# Altium schematic sheet xbowtie3.SchDoc
size A3; SheetNumber: 3; SheetTotal: 3
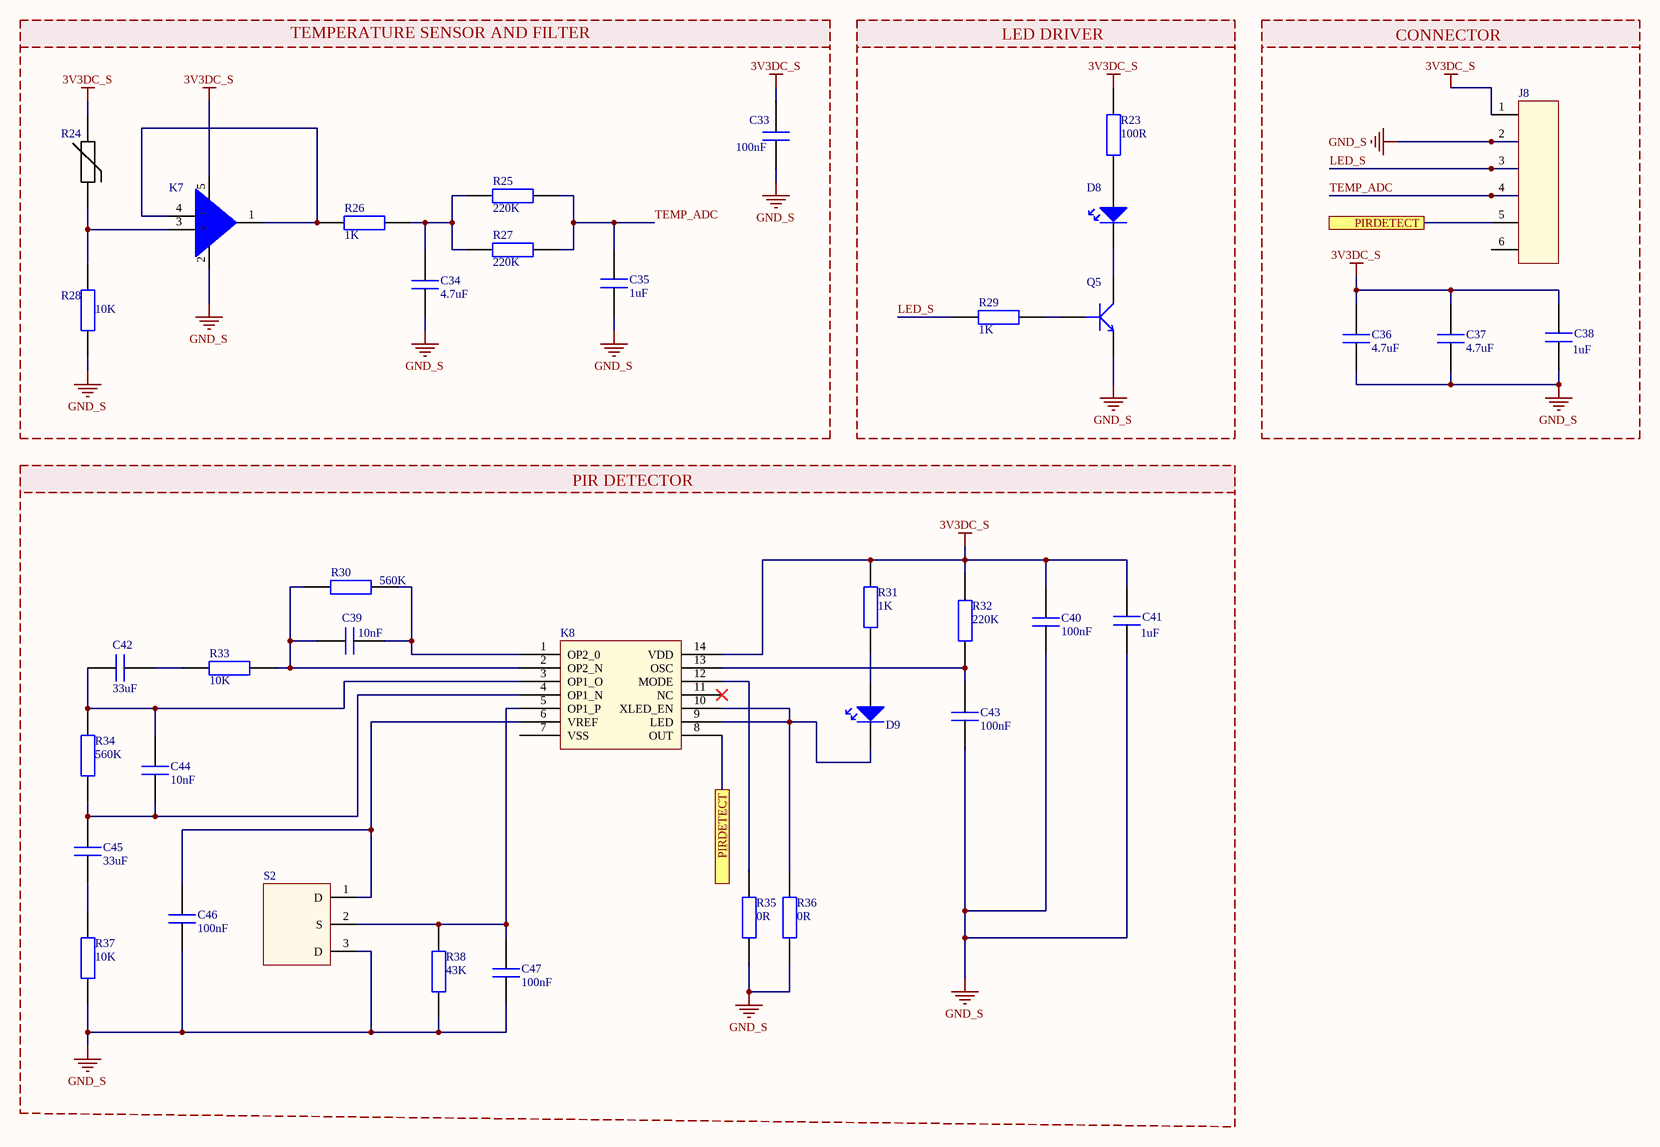
[diagram p0: xbowtie3.SchDoc]

## Parts
C33  100nF  [CAP_CER 0805]
C34  4.7uF  [CAP_CER 0805]
C35  Capacitance: 1uF  [CAP_CER 0805]  (hidden comment: CAP CER 1uF 0805)
C36  4.7uF  [CAP_CER 0805]
C37  4.7uF  [CAP_CER 0805]
C38  Capacitance: 1uF  [CAP_CER 0805]  (hidden comment: CAP CER 1uF 0805)
C39  10nF
C40  Capacitance: 100nF  (hidden comment: CAP CER 100nF 0603)
C41  Capacitance: 1uF  [CAP_CER 0805]  (hidden comment: CAP CER 1uF 0805)
C42  33uF  [CAP 1206]
C43  Capacitance: 100nF  (hidden comment: CAP CER 100nF 0603)
C44  10nF
C45  33uF  [CAP 1206]
C46  Capacitance: 100nF  (hidden comment: CAP CER 100nF 0603)
C47  Capacitance: 100nF  (hidden comment: CAP CER 100nF 0603)
D8  LED RED 0805  [LED 805]  (value not drawn)
D9  LED GREEN  [LED 805]  (value not drawn)
J8  64800611622  [64800611622]  (value not drawn)
K7  OPA314AIDBVR  [OPA314AIDBVR]  (value not drawn)
K8  NCS36000DRG  [NCS36000DRG]  (value not drawn)
Q5  MMBT3904-7-F  [MMBT3904-7-F]  (value not drawn)
R23  100R  [RES_0603]
R24  TFPT1206L1002FM  [TFPT1206L1002FM]  (value not drawn)
R25  220K  [RES_0603]
R26  1K  [RES_0603]
R27  220K  [RES_0603]
R28  10K  [RES_0603]
R29  1K  [RES_0603]
R30  560K  [RES_0603]
R31  1K  [RES_0603]
R32  220K  [RES_0603]
R33  10K  [RES_0603]
R34  560K  [RES_0603]
R35  0R  [RES_0603]
R36  0R  [RES_0603]
R37  10K  [RES_0603]
R38  43K  [RES_0603]
S2  LHI 878/3902  [LHI 878]  (value not drawn)

## Ports
PIRDETECT

## Nets
3V3DC_S: C33.2 C36.2 C37.2 C38.2 C40.2 C41.2 J8.1(VCC) K7.5(V+) K8.14(VDD) R23.2 R24.2 R31.2 R32.2
GND_S: C33.1 C34.1 C35.1 C36.1 C37.1 C38.1 C40.1 C41.1 C43.1 C46.1 C47.1 J8.2(RX) K7.2(V-) Q5.2(E) R28.2 R35.1 R36.1 R37.1 R38.1 S2.3(D)
LED_S: J8.3(TX) R29.1
PIRDETECT: J8.5(GND) K8.8(OUT) ; port PIRDETECT
TEMP_ADC: C35.2 J8.4(NC) R25.2 R27.2
NetC34_2: C34.2 R25.1 R26.2 R27.1
NetC39_1: C39.1 K8.2(OP2_N) R30.1 R33.2
NetC39_2: C39.2 K8.1(OP2_0) R30.2
NetC42_1: C42.1 C44.2 K8.3(OP1_O) R34.2
NetC42_2: C42.2 R33.1
NetC43_2: C43.2 K8.13(OSC) R32.1
NetC44_1: C44.1 C45.2 K8.4(OP1_N) R34.1
NetC45_1: C45.1 R37.2
NetC46_2: C46.2 K8.6(VREF) S2.1(D)
NetC47_2: C47.2 K8.5(OP1_P) R38.2 S2.2(S)
NetD8_1: D8.1 Q5.C
NetD8_2: D8.2 R23.1
NetD9_1: D9.1 K8.9(LED) K8.10(XLED_EN) R36.2
NetD9_2: D9.2 R31.1
NetK7_1: K7.1(OUT) K7.4(-) R26.1
NetK7_3: K7.3(+) R24.1 R28.1
NetK8_12: K8.12(MODE) R35.2
NetQ5_1: Q5.1(B) R29.2

Not connected (* = marked no-connect by the designer): J8 6(GND); K8 7(VSS) 11(NC)*

## Notes on the sheet
- TEMPERATURE SENSOR AND FILTER
- LED DRIVER
- CONNECTOR
- PIR DETECTOR
- (in symbol OPA314AIDBVR) _

## Library data of the parts
C33 = CAP CER 100nF 0805
C34 C36 C37 = CAP CER 4.7uF 0805: Manufacturer: Samsung; Manufacturer Part Number: CL21A475KBQNNNE; Material: 4241ConductorMaterial; Tolerance: 10%; Voltage Rating: 50V; Dielectric: X5R; Supplier 1: Digikey; RoHS: Yes; Category: Ceramic Capacitors; Stock 1: 277343; Pricing 1: 1=0,23, 10=0,148, 50=0,104, 100=0,084, 500=0,06244, 1000=0,05464 (USD); Mount: Surface Mount; Case/Package: 0805; Case Code (Metric): 2012; Case Code (Imperial): 0805; Min Operating Temperature: -55°C; Max Operating Temperature: 85°C; Packaging: Tape and Reel; Series: CL; Voltage Rating (DC): 50V; Package Quantity: 1; Length: 2mm; Width: 0.049inch; Thickness: 0.055inch; Depth: 1.25mm; Radiation Hardening: No; RoHS Compliant: Yes; ComponentLink1URL: https://datasheet.ciiva.com/25797/cl21a475kbqnnne-25797730.pdf?src-supplier=Digikey; ComponentLink1Description: https://datasheet.ciiva.com/25797/cl21a475kbqnnne-25797730.pdf?src-supplier=Digikey; ComponentLink2URL: https://datasheet.ciiva.com/16428/cl21a475kbqnnne-16428877.pdf?src-supplier=Future+Electronics; ComponentLink2Description: https://datasheet.ciiva.com/16428/cl21a475kbqnnne-16428877.pdf?src-supplier=Future+Electronics; ComponentLink3URL: https://datasheet.ciiva.com/26838/getdatasheetpartid-470982-26838620.pdf?src-supplier=Verical; ComponentLink3Description: https://datasheet.ciiva.com/26838/getdatasheetpartid-470982-26838620.pdf?src-supplier=Verical; Supplier Part Number 1: 1276-1248-1-ND; Capacitance: 4.7uF
C35 C38 C41 = CAP CER 1uF 0805: CAP CER 1uF %10 0805; Manufacturer: Samsung; Manufacturer Part Number: CL21B105KBFNNNE; Material: Ceramic; Tolerance: 10%; Voltage Rating: 50V; Dielectric: X7R; Supplier 1: Digikey; RoHS: Yes; Category: Ceramic Capacitors; Stock 1: 1550845; Pricing 1: 1=0,11, 10=0,075, 50=0,045, 100=0,0354, 500=0,02616, 1000=0,02165 (USD); Mount: Surface Mount; Case/Package: 0805; Case Code (Metric): 2012; Case Code (Imperial): 0805; Min Operating Temperature: -55°C; Max Operating Temperature: 125°C; Packaging: Tape and Reel; Package Quantity: 1; Voltage: 50V; Series: CL; Construction: Flat; Voltage Rating (DC): 50V; Length: 2mm; Width: 0.049inch; Height: 1.25mm; Thickness: 0.053inch; Depth: 1.25mm; Radiation Hardening: No; RoHS Compliant: Yes; ComponentLink1URL: https://datasheet.ciiva.com/25800/cl21b105kbfnnne-25800291.pdf?src-supplier=Digikey; ComponentLink1Description: https://datasheet.ciiva.com/25800/cl21b105kbfnnne-25800291.pdf?src-supplier=Digikey; Supplier Part Number 1: 1276-1029-1-ND
C39 C44 = CAP CER 10nF 0603: Manufacturer: Walsin Technologies; Manufacturer Part Number: 0603B103K160CT; Supplier 1: Digikey; RoHS: Yes; Category: Ceramic Capacitors; Stock 1: 97748; Pricing 1: 1=0,1, 10=0,032, 50=0,0182, 100=0,0141, 500=0,0106, 1000=0,00833 (USD); Lead Free: 5697LeadFree; ComponentLink1URL: http://www.farnell.com/datasheets/1958513.pdf?src-supplier=Farnell; ComponentLink1Description: http://www.farnell.com/datasheets/1958513.pdf?src-supplier=Farnell; ComponentLink2URL: https://datasheet.octopart.com/0603B103K160CT-Walsin-Technologies-datasheet-136037192.pdf?src-supplier=Future+Electronics; ComponentLink2Description: https://datasheet.octopart.com/0603B103K160CT-Walsin-Technologies-datasheet-136037192.pdf?src-supplier=Future+Electronics; ComponentLink3URL: http://www.passivecomponent.com/wp-content/uploads/2018/10/MLCC.pdf?src-supplier=Digikey; ComponentLink3Description: http://www.passivecomponent.com/wp-content/uploads/2018/10/MLCC.pdf?src-supplier=Digikey; ComponentLink4URL: https://datasheet.octopart.com/0603B103K160CT-Walsin-Technologies-datasheet-85392065.pdf?src-supplier=Element14; ComponentLink4Description: https://datasheet.octopart.com/0603B103K160CT-Walsin-Technologies-datasheet-85392065.pdf?src-supplier=Element14; ComponentLink5URL: https://datasheet.octopart.com/0603B103K160CT-Walsin-Technologies-datasheet-62066062.pdf?src-supplier=TME; ComponentLink5Description: https://datasheet.octopart.com/0603B103K160CT-Walsin-Technologies-datasheet-62066062.pdf?src-supplier=TME; Supplier Part Number 1: 1292-1384-1-ND
C40 C43 C46 C47 = CAP CER 100nF 0603: Multilayer Ceramic Capacitor, 0.1 uF, 50 V, ± 10%, X7R, 0603 [1608 Metric]; Manufacturer: KEMET; Manufacturer Part Number: C0603C104K5RACTU; Material: 4241ConductorMaterial; Voltage Rating: 50V; Temperature Coefficient: 30ppm/°C; ComponentLink1URL: https://datasheet.ciiva.com/46444/1769893-46444984.pdf?src-supplier=Element14; ComponentLink1Description: https://datasheet.ciiva.com/46444/1769893-46444984.pdf?src-supplier=Element14; ComponentLink2URL: https://datasheet.ciiva.com/46444/1769893-46444985.pdf?src-supplier=Element14; ComponentLink2Description: https://datasheet.ciiva.com/46444/1769893-46444985.pdf?src-supplier=Element14; ComponentLink3URL: https://datasheet.ciiva.com/14906/partnumbering-e-01-14906427.pdf?src-supplier=Digikey; ComponentLink3Description: https://datasheet.ciiva.com/14906/partnumbering-e-01-14906427.pdf?src-supplier=Digikey; ComponentLink4URL: https://datasheet.ciiva.com/14906/partnumbering-e-01-14906426.pdf?src-supplier=Digikey; ComponentLink4Description: https://datasheet.ciiva.com/14906/partnumbering-e-01-14906426.pdf?src-supplier=Digikey; ComponentLink5URL: https://datasheet.ciiva.com/14906/partnumbering-e-01-14906428.pdf?src-supplier=Digikey; ComponentLink5Description: https://datasheet.ciiva.com/14906/partnumbering-e-01-14906428.pdf?src-supplier=Digikey; Supplier 1: Digikey; Category: Ceramic Capacitors; Stock 1: 3473994; Pricing 1: 1=0,11, 10=0,074, 50=0,0424, 100=0,0329, 500=0,02474, 1000=0,01944 (USD); Mount: Surface Mount; Case/Package: 0603; Min Operating Temperature: -55°C; Max Operating Temperature: 125°C; Tolerance: 10%; Packaging: Tape and Reel; Series: SMD Comm X7R; Dielectric: X7R; Voltage: 50V; Length: 0.063inch; Width: 0.031inch; Thickness: 0.034inch; RoHS Compliant: Yes; Lead Free: 5697LeadFree; ComponentLink6URL: https://datasheet.octopart.com/C0603C104K5RACTU-KEMET-datasheet-176142159.pdf?src-supplier=Farnell; ComponentLink6Description: https://datasheet.octopart.com/C0603C104K5RACTU-KEMET-datasheet-176142159.pdf?src-supplier=Farnell; ComponentLink7URL: https://datasheet.octopart.com/C0603C104K5RACTU-KEMET-datasheet-149521864.pdf?src-supplier=Farnell; ComponentLink7Description: https://datasheet.octopart.com/C0603C104K5RACTU-KEMET-datasheet-149521864.pdf?src-supplier=Farnell; ComponentLink8URL: https://datasheet.octopart.com/C0603C104K5RACTU-KEMET-datasheet-101575654.pdf?src-supplier=Farnell; ComponentLink8Description: https://datasheet.octopart.com/C0603C104K5RACTU-KEMET-datasheet-101575654.pdf?src-supplier=Farnell; ComponentLink9URL: https://datasheet.octopart.com/C0603C104K5RAC-TU-Kemet-datasheet-7833651.pdf?src-supplier=Farnell; ComponentLink9Description: https://datasheet.octopart.com/C0603C104K5RAC-TU-Kemet-datasheet-7833651.pdf?src-supplier=Farnell; ComponentLink10URL: https://datasheet.octopart.com/C0603C104K5RAC-TU-Kemet-datasheet-7601896.pdf?src-supplier=Farnell; ComponentLink10Description: https://datasheet.octopart.com/C0603C104K5RAC-TU-Kemet-datasheet-7601896.pdf?src-supplier=Farnell; ComponentLink11URL: https://datasheet.octopart.com/C0603C104K5RAC-TU-Kemet-datasheet-5316294.pdf?src-supplier=Farnell; ComponentLink11Description: https://datasheet.octopart.com/C0603C104K5RAC-TU-Kemet-datasheet-5316294.pdf?src-supplier=Farnell; ComponentLink12URL: https://datasheet.octopart.com/C0603C104K5RAC-TU-Kemet-datasheet-5314837.pdf?src-supplier=Farnell; ComponentLink12Description: https://datasheet.octopart.com/C0603C104K5RAC-TU-Kemet-datasheet-5314837.pdf?src-supplier=Farnell; ComponentLink13URL: https://datasheet.octopart.com/C0603C104K5RAC-TU-Kemet-datasheet-8092359.pdf?src-supplier=Farnell; ComponentLink13Description: https://datasheet.octopart.com/C0603C104K5RAC-TU-Kemet-datasheet-8092359.pdf?src-supplier=Farnell; ComponentLink14URL: https://datasheet.octopart.com/C0603C104K5RAC-TU-Kemet-datasheet-5314449.pdf?src-supplier=Farnell; ComponentLink14Description: https://datasheet.octopart.com/C0603C104K5RAC-TU-Kemet-datasheet-5314449.pdf?src-supplier=Farnell; ComponentLink15URL: https://datasheet.octopart.com/C0603C104K5RAC-TU-Kemet-datasheet-5314969.pdf?src-supplier=Farnell; ComponentLink15Description: https://datasheet.octopart.com/C0603C104K5RAC-TU-Kemet-datasheet-5314969.pdf?src-supplier=Farnell; ComponentLink16URL: https://datasheet.octopart.com/C0603C104K5RAC-TU-Kemet-datasheet-5314627.pdf?src-supplier=Farnell; ComponentLink16Description: https://datasheet.octopart.com/C0603C104K5RAC-TU-Kemet-datasheet-5314627.pdf?src-supplier=Farnell; ComponentLink17URL: https://datasheet.octopart.com/C0603C104K5RAC-TU-Kemet-datasheet-5389132.pdf?src-supplier=Farnell; ComponentLink17Description: https://datasheet.octopart.com/C0603C104K5RAC-TU-Kemet-datasheet-5389132.pdf?src-supplier=Farnell; ComponentLink18URL: https://datasheet.octopart.com/C0603C104K5RAC-TU-Kemet-datasheet-5313836.pdf?src-supplier=Farnell; ComponentLink18Description: https://datasheet.octopart.com/C0603C104K5RAC-TU-Kemet-datasheet-5313836.pdf?src-supplier=Farnell; ComponentLink19URL: https://datasheet.octopart.com/C0603C104K5RAC-TU-Kemet-datasheet-8111010.pdf?src-supplier=Farnell; ComponentLink19Description: https://datasheet.octopart.com/C0603C104K5RAC-TU-Kemet-datasheet-8111010.pdf?src-supplier=Farnell; ComponentLink20URL: https://datasheet.octopart.com/C0603C104K5RAC-TU-Kemet-datasheet-7627733.pdf?src-supplier=Farnell; ComponentLink20Description: https://datasheet.octopart.com/C0603C104K5RAC-TU-Kemet-datasheet-7627733.pdf?src-supplier=Farnell; ComponentLink21URL: https://datasheet.octopart.com/C0603C104K5RAC-TU-Kemet-datasheet-5315946.pdf?src-supplier=Farnell; ComponentLink21Description: https://datasheet.octopart.com/C0603C104K5RAC-TU-Kemet-datasheet-5315946.pdf?src-supplier=Farnell; ComponentLink22URL: https://datasheet.octopart.com/C0603C104K5RACTU-KEMET-datasheet-171829795.pdf?src-supplier=Newark; ComponentLink22Description: https://datasheet.octopart.com/C0603C104K5RACTU-KEMET-datasheet-171829795.pdf?src-supplier=Newark; ComponentLink23URL: https://datasheet.octopart.com/C0603C104K5RAC-TU-Kemet-datasheet-5313890.pdf?src-supplier=Newark; ComponentLink23Description: https://datasheet.octopart.com/C0603C104K5RAC-TU-Kemet-datasheet-5313890.pdf?src-supplier=Newark; ComponentLink24URL: https://datasheet.octopart.com/C0603C104K5RACTU-Kemet-datasheet-12608295.pdf?src-supplier=Newark; ComponentLink24Description: https://datasheet.octopart.com/C0603C104K5RACTU-Kemet-datasheet-12608295.pdf?src-supplier=Newark; ComponentLink25URL: https://datasheet.octopart.com/C0603C104K5RACTU-Kemet-datasheet-11992184.pdf?src-supplier=Newark; ComponentLink25Description: https://datasheet.octopart.com/C0603C104K5RACTU-Kemet-datasheet-11992184.pdf?src-supplier=Newark; ComponentLink26URL: https://datasheet.octopart.com/C0603C104K5RACTU-Kemet-datasheet-10942409.pdf?src-supplier=Newark; ComponentLink26Description: https://datasheet.octopart.com/C0603C104K5RACTU-Kemet-datasheet-10942409.pdf?src-supplier=Newark; ComponentLink27URL: https://datasheet.octopart.com/C0603C104K5RACTU-Kemet-datasheet-10404442.pdf?src-supplier=Newark; ComponentLink27Description: https://datasheet.octopart.com/C0603C104K5RACTU-Kemet-datasheet-10404442.pdf?src-supplier=Newark; ComponentLink28URL: https://datasheet.octopart.com/C0603C104K5RAC-TU-Kemet-datasheet-5390537.pdf?src-supplier=Newark; ComponentLink28Description: https://datasheet.octopart.com/C0603C104K5RAC-TU-Kemet-datasheet-5390537.pdf?src-supplier=Newark; ComponentLink29URL: https://datasheet.octopart.com/C0603C104K5RAC-TU-Kemet-datasheet-7541751.pdf?src-supplier=Newark; ComponentLink29Description: https://datasheet.octopart.com/C0603C104K5RAC-TU-Kemet-datasheet-7541751.pdf?src-supplier=Newark; ComponentLink30URL: https://datasheet.octopart.com/C0603C104K5RACTU-Kemet-datasheet-8764837.pdf?src-supplier=Newark; ComponentLink30Description: https://datasheet.octopart.com/C0603C104K5RACTU-Kemet-datasheet-8764837.pdf?src-supplier=Newark; ComponentLink31URL: https://datasheet.octopart.com/C0603C104K5RACTU-Kemet-datasheet-8480123.pdf?src-supplier=Newark; ComponentLink31Description: https://datasheet.octopart.com/C0603C104K5RACTU-Kemet-datasheet-8480123.pdf?src-supplier=Newark; ComponentLink32URL: https://datasheet.octopart.com/C0603C104K5RACTU-Kemet-datasheet-5393970.pdf?src-supplier=Newark; ComponentLink32Description: https://datasheet.octopart.com/C0603C104K5RACTU-Kemet-datasheet-5393970.pdf?src-supplier=Newark; ComponentLink33URL: https://datasheet.octopart.com/C0603C104K5RACTU-Kemet-datasheet-8502025.pdf?src-supplier=Newark; ComponentLink33Description: https://datasheet.octopart.com/C0603C104K5RACTU-Kemet-datasheet-8502025.pdf?src-supplier=Newark; ComponentLink34URL: https://datasheet.octopart.com/C0603C104K5RACTU-Kemet-datasheet-161801.pdf?src-supplier=Newark; ComponentLink34Description: https://datasheet.octopart.com/C0603C104K5RACTU-Kemet-datasheet-161801.pdf?src-supplier=Newark; ComponentLink35URL: https://datasheet.octopart.com/C0603C104K5RACTU-Kemet-datasheet-32036385.pdf?src-supplier=Electro+Sonic; ComponentLink35Description: https://datasheet.octopart.com/C0603C104K5RACTU-Kemet-datasheet-32036385.pdf?src-supplier=Electro+Sonic; ComponentLink36URL: https://datasheet.octopart.com/C0603C104K5RACTU-KEMET-datasheet-157246124.pdf?src-supplier=Electro+Sonic; ComponentLink36Description: https://datasheet.octopart.com/C0603C104K5RACTU-KEMET-datasheet-157246124.pdf?src-supplier=Electro+Sonic; ComponentLink37URL: https://datasheet.octopart.com/C0603C104K5RACTU-KEMET-datasheet-164512540.pdf?src-supplier=TME; ComponentLink37Description: https://datasheet.octopart.com/C0603C104K5RACTU-KEMET-datasheet-164512540.pdf?src-supplier=TME; ComponentLink38URL: https://datasheet.octopart.com/C0603C104K5RACTU-Kemet-datasheet-67830781.pdf?src-supplier=TME; ComponentLink38Description: https://datasheet.octopart.com/C0603C104K5RACTU-Kemet-datasheet-67830781.pdf?src-supplier=TME; ComponentLink39URL: https://datasheet.octopart.com/C0603C104K5RACTU-KEMET-datasheet-68331906.pdf?src-supplier=TME; ComponentLink39Description: https://datasheet.octopart.com/C0603C104K5RACTU-KEMET-datasheet-68331906.pdf?src-supplier=TME; ComponentLink40URL: https://datasheet.octopart.com/C0603C104K5RAC7867-Kemet-datasheet-62098571.pdf?src-supplier=TME; ComponentLink40Description: https://datasheet.octopart.com/C0603C104K5RAC7867-Kemet-datasheet-62098571.pdf?src-supplier=TME; ComponentLink41URL: https://datasheet.octopart.com/C0603C104K5RAC7867-Kemet-datasheet-17577222.pdf?src-supplier=TME; ComponentLink41Description: https://datasheet.octopart.com/C0603C104K5RAC7867-Kemet-datasheet-17577222.pdf?src-supplier=TME; ComponentLink42URL: https://datasheet.octopart.com/C0603C104K5RACTU-KEMET-datasheet-137357759.pdf?src-supplier=Upverter; ComponentLink42Description: https://datasheet.octopart.com/C0603C104K5RACTU-KEMET-datasheet-137357759.pdf?src-supplier=Upverter; ComponentLink43URL: https://datasheet.octopart.com/C0603C104K5RACTU-KEMET-datasheet-137357764.pdf?src-supplier=Upverter; ComponentLink43Description: https://datasheet.octopart.com/C0603C104K5RACTU-KEMET-datasheet-137357764.pdf?src-supplier=Upverter; ComponentLink44URL: https://datasheet.octopart.com/C0603C104K5RACTU-KEMET-datasheet-110724412.pdf?src-supplier=RS+(Formerly+Allied+Electronics); ComponentLink44Description: https://datasheet.octopart.com/C0603C104K5RACTU-KEMET-datasheet-110724412.pdf?src-supplier=RS+(Formerly+Allied+Electronics); ComponentLink45URL: https://datasheet.octopart.com/C0603C104K5RACTU-Kemet-datasheet-464.pdf?src-supplier=RS+(Formerly+Allied+Electronics); ComponentLink45Description: https://datasheet.octopart.com/C0603C104K5RACTU-Kemet-datasheet-464.pdf?src-supplier=RS+(Formerly+Allied+Electronics); ComponentLink46URL: https://datasheet.octopart.com/C0603C104K5RACTU-KEMET-datasheet-84169754.pdf; ComponentLink46Description: https://datasheet.octopart.com/C0603C104K5RACTU-KEMET-datasheet-84169754.pdf; ComponentLink47URL: https://datasheet.octopart.com/C0603C104K5RACTU-Kemet-datasheet-24570007.pdf?src-supplier=Element14; ComponentLink47Description: https://datasheet.octopart.com/C0603C104K5RACTU-Kemet-datasheet-24570007.pdf?src-supplier=Element14; ComponentLink48URL: https://datasheet.octopart.com/C0603C104K5RACTU-Kemet-datasheet-22084244.pdf?src-supplier=Element14; ComponentLink48Description: https://datasheet.octopart.com/C0603C104K5RACTU-Kemet-datasheet-22084244.pdf?src-supplier=Element14; ComponentLink49URL: https://datasheet.octopart.com/C0603C104K5RACTU-Kemet-datasheet-21389238.pdf?src-supplier=Element14; ComponentLink49Description: https://datasheet.octopart.com/C0603C104K5RACTU-Kemet-datasheet-21389238.pdf?src-supplier=Element14; ComponentLink50URL: https://datasheet.octopart.com/C0603C104K5RACTU-Kemet-datasheet-11723057.pdf?src-supplier=Arrow+Electronics; ComponentLink50Description: https://datasheet.octopart.com/C0603C104K5RACTU-Kemet-datasheet-11723057.pdf?src-supplier=Arrow+Electronics; ComponentLink51URL: https://datasheet.octopart.com/C0603C104K5RAC7867-KEMET-datasheet-164857143.pdf?src-supplier=Burklin+Elektronik; ComponentLink51Description: https://datasheet.octopart.com/C0603C104K5RAC7867-KEMET-datasheet-164857143.pdf?src-supplier=Burklin+Elektronik; ComponentLink52URL: https://datasheet.octopart.com/C0603C104K5RAC-TU-Kemet-datasheet-8187850.pdf?src-supplier=Jameco; ComponentLink52Description: https://datasheet.octopart.com/C0603C104K5RAC-TU-Kemet-datasheet-8187850.pdf?src-supplier=Jameco; ComponentLink53URL: https://datasheet.octopart.com/C0603C104K5RACTU-Kemet-datasheet-122295.pdf?src-supplier=Digikey; ComponentLink53Description: https://datasheet.octopart.com/C0603C104K5RACTU-Kemet-datasheet-122295.pdf?src-supplier=Digikey; Supplier Part Number 1: 399-C0603C104K5RAC7867CT-ND
C42 C45 = CAP CER 33 uF 1206
J8 = 64800611622_conn_6pin: 1.50 mm, 6 pin connector; Manufacturer: Wurth Electronics; Supplier 1: Digikey; Manufacturer Part Number: 64800611622; RoHS: No; Category: Uncategorized; Stock 1: 589; Pricing 1: 1=0,42, 50=0,406, 100=0,384, 250=0,361, 500=0,339 (USD); Supplier Part Number 1: 732-64800611622-ND
Q5 = MMBT3904-7-F: Transistor General Purpose BJT NPN 40 Volt 0.2A Automotive 3-Pin SOT-23; Manufacturer: Diodes Zetex; Max Power Dissipation: 300mW; Collector Emitter Voltage (VCEO): 40V; Max Collector Current: 200mA; Collector Base Voltage (VCBO): 60V; Power Dissipation: 350mW; Frequency: 300MHz; hFE Min: 100; Number of Elements: 1; Emitter Base Voltage (VEBO): 6V; Collector Emitter Saturation Voltage: 300mV; Supplier 1: Digikey; Manufacturer Part Number: MMBT3904-7-F; RoHS: Yes; Category: BJTs; Stock 1: 5031738; Pricing 1: 1=0,12, 10=0,086, 100=0,0467, 500=0,03666, 1000=0,02545 (USD); Mount: Surface Mount; Case/Package: SOT-23; Number of Pins: 3; Weight: 0.000282oz; Min Operating Temperature: -55°C; Max Operating Temperature: 150°C; Polarity: NPN; Packaging: Tape and Reel; Voltage Rating (DC): 40V; Package Quantity: 3000; Transition Frequency: 300MHz; Collector Emitter Breakdown Voltage: 40V; Max Breakdown Voltage: 40V; Continuous Collector Current: 200mA; Max Frequency: 300MHz; Gain Bandwidth Product: 300MHz; Series: Automotive, AEC-Q101; Collector-emitter Voltage-Max: 300mV; Length: 3.05mm; Width: 1.4mm; Height: 1mm; Radiation Hardening: No; Reach SVHC Compliant: No; Lead Free: Lead Free; RoHS Compliant: Yes; ComponentLink1URL: https://datasheet.ciiva.com/11201/ds30036-11201778.pdf?src-supplier=Avnet; ComponentLink1Description: https://datasheet.ciiva.com/11201/ds30036-11201778.pdf?src-supplier=Avnet; ComponentLink2URL: https://datasheet.ciiva.com/15138/getdatasheetpartid-53265-15138780.pdf?src-supplier=Verical; ComponentLink2Description: https://datasheet.ciiva.com/15138/getdatasheetpartid-53265-15138780.pdf?src-supplier=Verical; ComponentLink3URL: https://datasheet.ciiva.com/22711/1915516-22711750.pdf?src-supplier=Element14; ComponentLink3Description: https://datasheet.ciiva.com/22711/1915516-22711750.pdf?src-supplier=Element14; ComponentLink4URL: https://datasheet.ciiva.com/11198/ds30036-11198999.pdf?src-supplier=Avnet; ComponentLink4Description: https://datasheet.ciiva.com/11198/ds30036-11198999.pdf?src-supplier=Avnet; ComponentLink5URL: https://datasheet.ciiva.com/6361/ds30036-6361256.pdf?src-supplier=Digikey; ComponentLink5Description: https://datasheet.ciiva.com/6361/ds30036-6361256.pdf?src-supplier=Digikey; ComponentLink6URL: https://datasheet.ciiva.com/6361/ds30036-6361254.pdf?src-supplier=Digikey; ComponentLink6Description: https://datasheet.ciiva.com/6361/ds30036-6361254.pdf?src-supplier=Digikey; Supplier Part Number 1: MMBT3904-FDICT-ND
R23 = RES 100 OHM 0603
R24 = TFPT1206L1002FM: Thermistor PTC 10K Ohm 1% 2-Pin 1206 Surface Mount Solder Pad T/R Automotive; Manufacturer: Vishay Dale; Resistance: 10kR; Power Rating: 125mW; Voltage: 40V; Supplier 1: Digikey; Manufacturer Part Number: TFPT1206L1002FM; RoHS: Yes; Category: Linear ICs; Stock 1: 9270; Pricing 1: 1=1,32, 10=0,992, 25=0,7936, 100=0,7274, 500=0,61166, 1000=0,54554 (USD); Mount: Surface Mount; Case/Package: 1206; Case Code (Imperial): 1206; Min Operating Temperature: -55°C; Max Operating Temperature: 125°C; Packaging: Tape and Reel; Package Quantity: 5000; Tolerance: 1%; Max Power Dissipation: 125mW; Termination: SMD/SMT; Series: TFPT; Resistance Tolerance: 1%; Length: 3.2mm; Width: 1.6mm; Height: 0.55mm; Lead Free: Lead Free; RoHS Compliant: Yes; ComponentLink1URL: https://datasheet.ciiva.com/2852/tfpt-2852076.pdf?src-supplier=Digikey; ComponentLink1Description: https://datasheet.ciiva.com/2852/tfpt-2852076.pdf?src-supplier=Digikey; Supplier Part Number 1: 541-3533-1-ND
R25 R27 R32 = RES 220K OHM 0603
R26 R29 R31 = RES 1K OHM 0603
R28 R33 R37 = RES 10K OHM 0603: Res Thin Film 0603 10K Ohm 0.1% 1/10W ±25ppm/°C Molded SMD SMD Punched Carrier T/R; Manufacturer: Panasonic; Manufacturer Part Number: ERA-3AEB103V; Resistance: 10kR; Power Rating: 100mW; Voltage Rating: 75V; Supplier 1: Digikey; RoHS: Yes; Category: Chip SMD Resistors; Stock 1: 16550; Pricing 1: 1=0,13, 10=0,098, 50=0,0778, 100=0,0697, 500=0,05308, 1000=0,04691 (USD); Mount: Surface Mount; Case/Package: 0603; Number of Pins: 2; Case Code (Metric): 1608; Case Code (Imperial): 0603; Size Code: 0603; Contact Plating: Tin; Min Operating Temperature: -55°C; Max Operating Temperature: 155°C; Temperature Coefficient: 25ppm/°C; Series: ERA-3A; Packaging: Tape and Reel; Tolerance: 0.1%; Number of Terminations: 2; Termination: SMD/SMT; Max Power Dissipation: 100mW; Resistor Type: Thin Film,Metal Film; Features: Automotive AEC-Q200; Voltage Rating (DC): 75V; Resistance Tolerance: 0.1%; Construction: Rectangular; Technology: METAL FILM; Package Quantity: 5000; Length: 1.6mm; Width: 0.8mm; Height: 0.45mm; Depth: 0.8mm; Ratings: AEC-Q200; Radiation Hardening: No; RoHS Compliant: Yes; Lead Free: 5697LeadFree; Reach SVHC Compliant: No; Military Standard: Not; Supplier Part Number 1: P10KDBCT-ND
R30 R34 = RES 560K OHM 0603
R35 R36 = RES 0 OHM 0603: Zero Ohm Resistor, Jumper, 0603 [1608 Metric], Thick Film, 100 mW, 1 A, Surface Mount; Manufacturer: Yageo; Manufacturer Part Number: RC0603JR-070RL; Voltage Rating: 50V; Max Power Dissipation: 100mW; Temperature Coefficient: 200ppm/°C; Tolerance: 1%; Resistance Tolerance: 5%; Resistance: 0mR; Supplier 1: Digikey; RoHS: Yes; Category: Chip SMD Resistors; Stock 1: 255925; Pricing 1: 1=0,1, 10=0,015, 25=0,0112, 50=0,0086, 100=0,006, 250=0,0048, 500=0,00386, 1000=0,00284 (USD); Case/Package: 0603; Number of Pins: 2; Case Code (Imperial): 0603; Case Code (Metric): 1608; Contact Plating: Tin,Matte; Size Code: 0603; Min Operating Temperature: -55°C; Max Operating Temperature: 155°C; Packaging: Tape and Reel; Features: Moisture Resistant; Series: RC; Number of Terminations: 2; Package Quantity: 5000; Power Rating: 100mW; Voltage Rating (DC): 50V; Termination: SMD/SMT; Resistor Type: Thick Film; Construction: Rectangular; Technology: THICK FILM; Length: 1.6mm; Width: 0.8mm; Height: 0.45mm; Depth: 0.8mm; Military Standard: Not; Lead Free: 5697LeadFree; RoHS Compliant: Yes; Reach SVHC Compliant: Unknown; Supplier Part Number 1: 311-0.0GRCT-ND
R38 = RES 43K OHM 0603
S2 = LHI 878/3902: Sensor Pyro Detector Dual Motion; Manufacturer: Excelitas; Supplier 1: Digikey; Manufacturer Part Number: LHI878/3902; RoHS: No; Category: Uncategorized; Supplier Part Number 1: 1601-LHI878/3902-ND